# EAGLE board ACB-Lite 3.2 (EAGLE 8.6.3), part 1 of 2
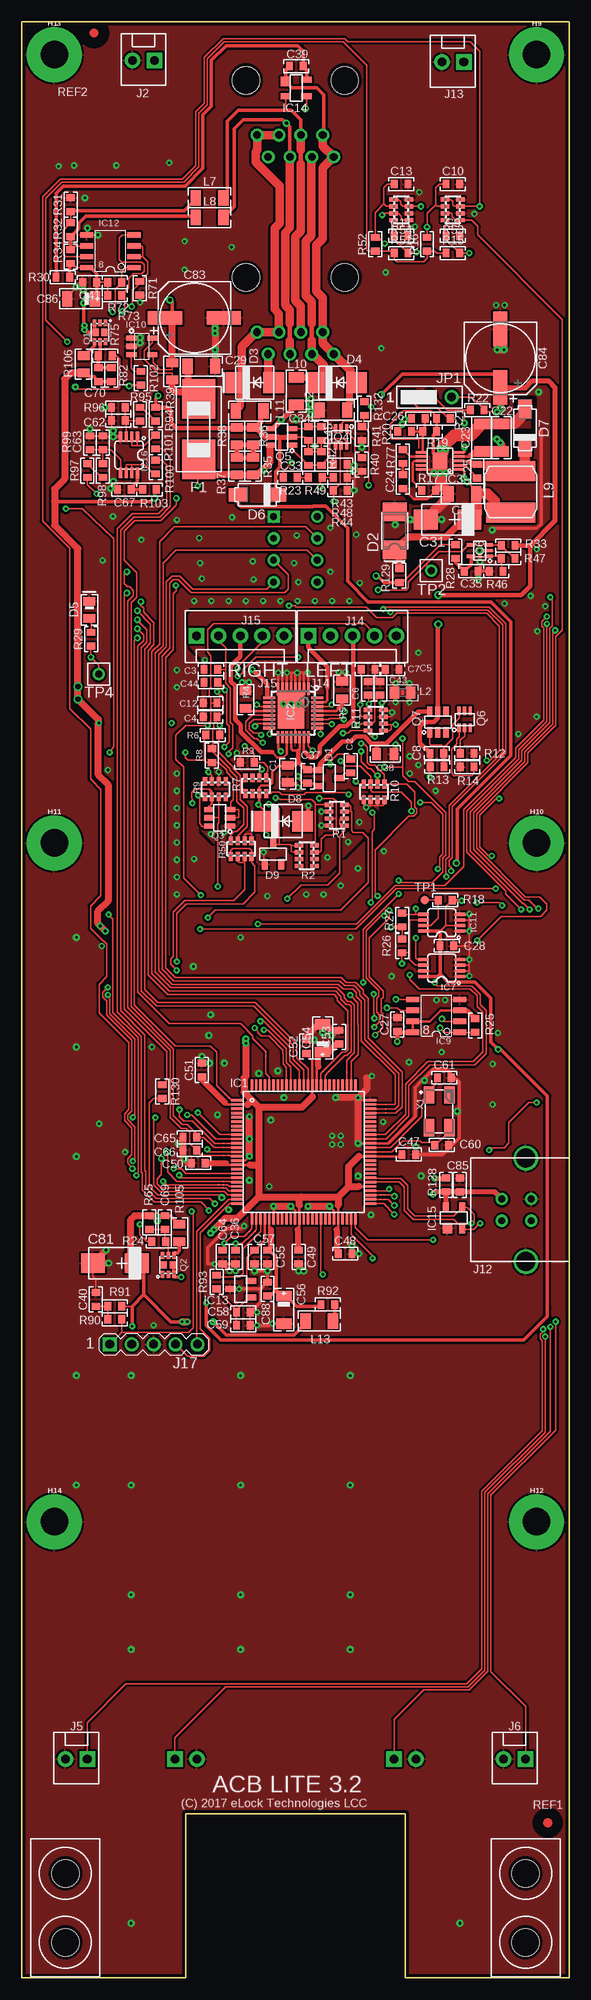
[diagram p3: board, top side]
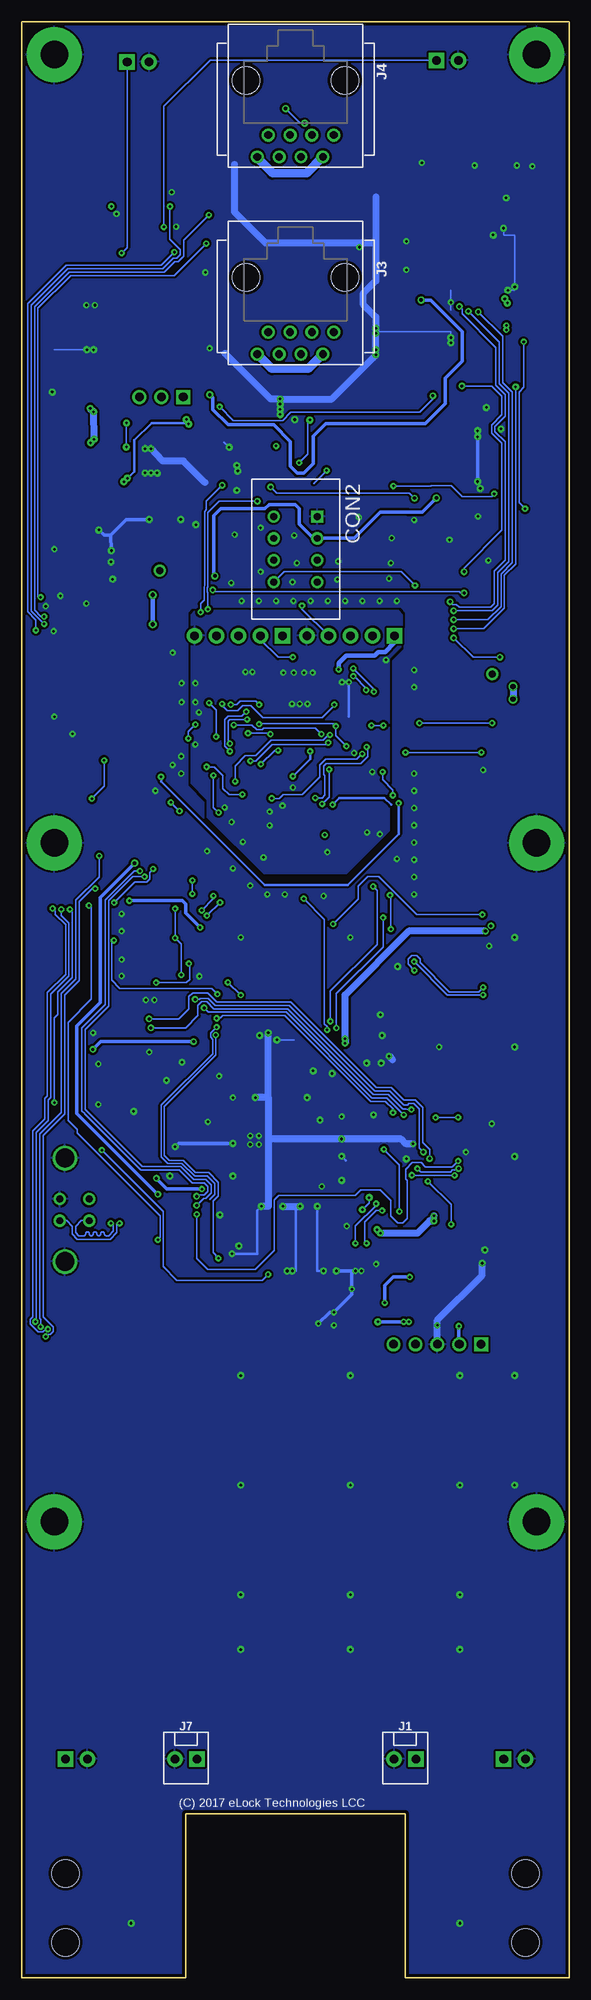
[diagram p4: board, bottom side, seen from below]

Size 63.5 x 226.82 mm. Coordinates in mm from the lower left corner, seen from the top.
Outline: 63.5,0 63.5,226.82 0,226.82 0,0 19.05,0 19.05,19.05 44.45,19.05 44.45,0 63.5,0
Copper layers (1*16): Top 0.035mm / dielectric 1.5mm / Bottom 0.035mm
Design rules "Class_6_0,15mm_0.2mm_conservative_set *": minimum track width 0.2mm, minimum drill 0.3mm, track to track 0.15mm, track to pad 0.15mm, pad to pad 0.2mm, via to via 0.15mm, smd to smd 0.2mm, copper to edge 0.35mm, drill to drill 0.2mm, minimum pad ring 0.3mm, minimum via ring 0.2mm, stop-mask expansion 0.1mm, vias tented up to drill 0.6mm, thermal gap 0.25mm
Net classes: 0 LV: drill 0.3 mm; 1 HV: drill 0.3 mm, clearance 0.3 mm to class 0
tRestrict: 34 lines

## Footprints (pad centres in the part's own frame; a part is rotated, then mirrored left to right if it is on the bottom)
0805 = smd 0.99 x 1.39: 1 -1,0; 2 1,0
0603 = smd 0.79 x 0.99: 1 -0.8,0; 2 0.8,0
1206 = smd 1.19 x 1.79: 1 -1.6,0; 2 1.6,0
CT-C = smd 2.743 x 2.311: + -2.54,0; - 2.54,0
1206-POL-C = smd 1.19 x 1.79: + -1.6,0; - 1.6,0
CAP_8MM_DIA_SMT = smd 1.59 x 3.99: 1 0,3.4; 2 0,-3.4
166087-4 = drill 0.8 square: 1 -3.81,2.54 | drill 0.8: 2 -1.27,2.54; 3 1.27,2.54; 4 3.81,2.54; 5 3.81,-2.54; 6 1.27,-2.54; 7 -1.27,-2.54; 8 -3.81,-2.54
SOT-23 = smd 0.69 x 1.19: 1 0.95,1.2; 2 -0.95,1.2; 3 0,-1.2
SMA = smd 2.159 x 2.743: + -2.311,0.003; - 2.108,-0.002
SMB = smd 2.4 x 2.4: A 2.2,0; C -2.2,0
0805-POL-D = smd 0.99 x 1.39: A 1,0; K -1,0
SMA' = smd 2.21 x 1.575: A -2.223,0; K 2.223,0
LITTLEFUSE0154 = smd 4.6 x 3.8: 1 3.5,0; 2 -3.5,0
CAM-HOLDER = hole 3.2: 0,4; 0,-4
STANDOFF-ELECTRICAL = drill 3.2 pad 6.35: P1 0,0
TQFP100_14X14_0,5MM = smd 1.39 x 0.28: 1 -7.7,6; 2 -7.7,5.5; 3 -7.7,5; 4 -7.7,4.5; 5 -7.7,4; 6 -7.7,3.5; 7 -7.7,3; 8 -7.7,2.5; 9 -7.7,2; 10 -7.7,1.5; 11 -7.7,1; 12 -7.7,0.5; 13 -7.7,0; 14 -7.7,-0.5; 15 -7.7,-1; 16 -7.7,-1.5; 17 -7.7,-2; 18 -7.7,-2.5; 19 -7.7,-3; 20 -7.7,-3.5; 21 -7.7,-4; 22 -7.7,-4.5; 23 -7.7,-5; 24 -7.7,-5.5; 25 -7.7,-6; 51 7.7,-6; 52 7.7,-5.5; 53 7.7,-5; 54 7.7,-4.5; 55 7.7,-4; 56 7.7,-3.5; 57 7.7,-3; 58 7.7,-2.5; 59 7.7,-2; 60 7.7,-1.5; 61 7.7,-1; 62 7.7,-0.5; 63 7.7,0; 64 7.7,0.5; 65 7.7,1; 66 7.7,1.5; 67 7.7,2; 68 7.7,2.5; 69 7.7,3; 70 7.7,3.5; 71 7.7,4; 72 7.7,4.5; 73 7.7,5; 74 7.7,5.5; 75 7.7,6 | smd 0.28 x 1.39: 26 -6,-7.7; 27 -5.5,-7.7; 28 -5,-7.7; 29 -4.5,-7.7; 30 -4,-7.7; 31 -3.5,-7.7; 32 -3,-7.7; 33 -2.5,-7.7; 34 -2,-7.7; 35 -1.5,-7.7; 36 -1,-7.7; 37 -0.5,-7.7; 38 0,-7.7; 39 0.5,-7.7; 40 1,-7.7; 41 1.5,-7.7; 42 2,-7.7; 43 2.5,-7.7; 44 3,-7.7; 45 3.5,-7.7; 46 4,-7.7; 47 4.5,-7.7; 48 5,-7.7; 49 5.5,-7.7; 50 6,-7.7; 76 6,7.7; 77 5.5,7.7; 78 5,7.7; 79 4.5,7.7; 80 4,7.7; 81 3.5,7.7; 82 3,7.7; 83 2.5,7.7; 84 2,7.7; 85 1.5,7.7; 86 1,7.7; 87 0.5,7.7; 88 0,7.7; 89 -0.5,7.7; 90 -1,7.7; 91 -1.5,7.7; 92 -2,7.7; 93 -2.5,7.7; 94 -3,7.7; 95 -3.5,7.7; 96 -4,7.7; 97 -4.5,7.7; 98 -5,7.7; 99 -5.5,7.7; 100 -6,7.7
SQFP-S-5X5-32 = smd 0.3 x 1.4: 1 -1.75,-2.8; 2 -1.25,-2.8; 3 -0.75,-2.8; 4 -0.25,-2.8; 5 0.25,-2.8; 6 0.75,-2.8; 7 1.25,-2.8; 8 1.75,-2.8; 17 1.75,2.8; 18 1.25,2.8; 19 0.75,2.8; 20 0.25,2.8; 21 -0.25,2.8; 22 -0.75,2.8; 23 -1.25,2.8; 24 -1.75,2.8 | smd 1.4 x 0.3: 9 2.8,-1.75; 10 2.8,-1.25; 11 2.8,-0.75; 12 2.8,-0.25; 13 2.8,0.25; 14 2.8,0.75; 15 2.8,1.25; 16 2.8,1.75; 25 -2.8,1.75; 26 -2.8,1.25; 27 -2.8,0.75; 28 -2.8,0.25; 29 -2.8,-0.25; 30 -2.8,-0.75; 31 -2.8,-1.25; 32 -2.8,-1.75 | smd 3.1 x 4.3: G 0.25,-0.35
MSOP10EXP = smd 0.29 x 1.19: 1 -1,-2.2; 2 -0.5,-2.2; 3 0,-2.2; 4 0.5,-2.2; 5 1,-2.2; 6 1,2.2; 7 0.5,2.2; 8 0,2.2; 9 -0.5,2.2; 10 -1,2.2 | smd 1.88 x 1.68: EP 0,0
SC-70-5 = smd 0.39 x 0.99: 1 -0.65,-1; 2 0,-1; 3 0.65,-1; 4 0.65,1; 5 -0.65,1
MSOP-08 = smd 0.38 x 1.2: 1 -1,-2.1; 2 -0.35,-2.1; 3 0.3,-2.1; 4 0.95,-2.1; 5 0.95,2.1; 6 0.3,2.1; 7 -0.35,2.1; 8 -1,2.1
SO-08 = smd 0.61 x 1.524: 1 -1.905,-2.743; 2 -0.635,-2.743; 3 0.635,-2.743; 4 1.905,-2.743; 5 1.905,2.743; 6 0.635,2.743; 7 -0.635,2.743; 8 -1.905,2.743
SOT23-5 = smd 0.6 x 1.2: 1 -0.95,-1.206; 2 0,-1.206; 3 0.95,-1.206; 4 0.95,1.206; 5 -0.95,1.206
SO08 = smd 0.61 x 1.524: 1 -1.905,-2.743; 2 -0.635,-2.743; 3 0.635,-2.743; 4 1.905,-2.743; 5 1.905,2.743; 6 0.635,2.743; 7 -0.635,2.743; 8 -1.905,2.743
SOT23 = smd 0.69 x 1.19: 1 0.95,1.2; 2 -0.95,1.2; 3 0,-1.2
SOT-143 = smd 1.09 x 1.19: 1 -0.75,-1.2 | smd 0.69 x 1.19: 2 0.95,-1.2; 3 0.95,1.2; 4 -0.95,1.2
3-641215-2 = drill 1 pad 1.8 square: 1 1.27,0 | drill 1 pad 1.8: 2 -1.27,0
RJ8-8-180 = drill 0.9 pad 1.4: 1 -4.445,6.35; 2 -3.175,8.89; 3 -1.905,6.35; 4 -0.635,8.89; 5 0.635,6.35; 6 1.905,8.89; 7 3.175,6.35; 8 4.445,8.89 | hole 3.2: 5.715,0; -5.715,0
USB_B_180 = drill 0.8 pad 1.4: 1_+5V 1.25,2.8; 2_D- -1.25,2.8; 3_D+ -1.25,-0.6; 4_GND 1.25,-0.6 | drill 2.2 pad 2.8: SH1 -6,0; SH2 6,0
3-641215-5 = drill 1 pad 1.8 square: 1 5.08,0 | drill 1 pad 1.8: 2 2.54,0; 3 0,0; 4 -2.54,0; 5 -5.08,0
MA05-1 = drill 1 pad 1.6 square: 1 -5.08,0 | drill 1 pad 1.6: 2 -2.54,0; 3 0,0; 4 2.54,0; 5 5.08,0
JP3CLOSE12 = drill 1 pad 1.626 square: 1 -2.54,0 | drill 1 pad 1.626: 2 0,0; 3 2.54,0
0805-0RTOP = smd 1.092 x 1.397: 1 -0.94,0; 2 0.94,0
NR6028 = smd 2.3 x 5.7: 1 2.4,0; 2 -2.4,0
TEMP-PAD = smd 0.2 x 0.2: P$1 0,0
MICRO_FET = smd 0.4 x 0.8: 1 -0.65,-1.1; 2 0,-1.1; 3 0.65,-1.1; 4 0.65,1.1; 5 0,1.1; 6 -0.65,1.1 | smd 0.7 x 0.86: P1 -0.5,0; P2 0.5,0
SSOT-6 = smd 0.6 x 1.2: 1 -0.95,-1.2; 2 0,-1.2; 3 0.95,-1.206; 4 0.95,1.2; 5 0,1.2; 6 -0.95,1.2
SC70-6 = smd 0.39 x 0.99: 1 -0.65,-1; 2 0,-1; 3 0.65,-1; 4 0.65,1; 5 0,1; 6 -0.65,1
0603-ARRAY = smd 0.49 x 0.99: 1 -1.2,-0.9; 2 -0.4,-0.9; 3 0.4,-0.9; 4 1.2,-0.9; 5 1.2,0.9; 6 0.4,0.9; 7 -0.4,0.9; 8 -1.2,0.9
SMD_ROUND_1MM = smd 1 x 1: P$1 0,0
TH_ROUND_14MM08MM = drill 0.8 pad 1.4: P$1 0,0
7B = smd 2 x 1.2: 1 -1.9,-1.2; 2 1.9,-1.2; 3 1.9,1.2; 4 -1.9,1.2

## Placement (x,y rotation side)
C1  4.7u/16V  [0805]  30.86,139.62 270 top
C2  10nF  [0603]  38.16,140.52 90 top
C3  10nF  [0603]  21.96,151.72 180 top
C4  10nF  [0603]  21.86,146.22 180 top
C5  10nF  [0603]  42.96,151.72 0 top
C6  10nF  [0603]  40.16,149.52 90 top
C7  10nF  [0603]  40.16,151.72 0 top
C8  100n  [0603]  48.15,142 0 top
C9  10nF  [0603]  50,201.99 0 top
C10  10nF  [0603]  50,207.99 0 top
C11  10nF  [0603]  44,201.99 0 top
C12  10nF  [0603]  21.86,147.82 180 top
C13  10nF  [0603]  44,207.99 0 top
C22  4u7/50  [1206]  55.6,178.59 90 top
C23  4u7/50  [1206]  53.35,178.59 90 top
C24  1n  [0603]  44.2,173.49 90 top
C25  470n/25  [0603]  52.8,174.69 270 top
C26  10p  [0603]  46,180.79 0 top
C27  100n  [0603]  43.57,110.55 90 top
C28  100n  [0603]  49.31,119.67 0 top
C29  4u7/50  [1206]  20.84,186.87 0 top
C30  47u/6.3  [1206]  51.1,172.09 180 top
C31  47uTC  [CT-C]  49.4,169.09 180 top
C33  100n  [0603]  33.24,176.17 270 top
C34  1n  [0603]  33.24,179.07 90 top
C35  100n  [0603]  52.1,163.09 0 top
C36  100n  [0603]  24.81,83.57 270 top
C37  1u/16V  [0603]  33.16,139.32 270 top
C38  4.7u/16V  [0805]  42.16,141.92 0 top
C39  100n  [0603]  31.85,221.65 180 top
C40  100n  [0603]  8.61,78.67 90 top
C41  100n  [0603]  7.9,196.59 180 top
C43  10nF  [0603]  41.56,149.52 90 top
C44  10nF  [0603]  21.96,150.22 180 top
C47  100n  [0603]  44.91,95.47 0 top
C48  1u  [0603]  37.51,83.97 0 top
C49  100n  [0603]  32.11,83.57 270 top
C50  1u  [0603]  20.51,94.47 180 top
C51  100n  [0603]  20.91,105.27 90 top
C52  1u  [0603]  33.01,107.97 90 top
C53  10u  [0603]  36.81,109.07 90 top
C54  10uTA  [1206-POL-C]  34.91,108.97 90 top
C55  100n  [0603]  28.51,83.57 270 top
C56  10uTA  [1206-POL-C]  30.41,77.47 270 top
C57  100n->10n  [0603]  27.01,83.57 270 top
C58  100n  [0603]  25.71,77.17 0 top
C59  1u->100n  [0603]  25.71,75.67 0 top
C60  18p  [0603]  48.71,96.57 0 top
C61  18p  [0603]  49.01,104.37 0 top
C62  1n  [0603]  11.23,180.58 180 top
C63  1n  [0603]  9.43,177.98 90 top
C64  100n  [0603]  23.31,83.57 270 top
C65  1n  [0603]  19.51,97.47 180 top
C66  10n  [0603]  19.51,95.97 180 top
C67  10u  [0603]  11.93,172.58 180 top
C69  1n  [0603]  16.61,87.57 270 top
C70  1n  [0603]  8.9,185.89 90 top
C81  47uTC  [CT-C]  10.81,82.87 180 top
C83  220u/25V  [CAP_8MM_DIA_SMT]  20.04,192.47 90 top
C84  220u/25V  [CAP_8MM_DIA_SMT]  55.5,187.79 180 top
C85  100n  [0603]  50.81,91.94 90 top
C86  10uTA  [1206-POL-C]  6.9,194.69 180 top
C88  10u  [0603]  28.51,79.87 90 top
CON2  166087-4  [166087-4]  31.75,165.64 270 bottom
D1  BAT54S  [SOT-23]  35.66,139.12 90 top
D2  SMLVT3V3  [SMA]  43.25,167.89 90 top
D3  P6SMB20A  [SMB]  27.04,184.97 0 top
D4  P6SMB20A  [SMB]  36.64,184.97 0 top
D5  LED-GREEN  [0805-POL-D]  7.86,158.62 270 top
D6  SS14  [SMA']  27.34,171.97 0 top
D7  SS14  [SMA']  58.35,179.69 270 top
D8  P6SMB16A  [SMB]  30.36,134.12 0 top
D9  BZX84C6V2  [SOT-23]  29.16,130.32 180 top
F1  T1A-LITTLEFUSE0154  [LITTLEFUSE0154]  20.54,179.57 90 top
H1  CAM-HOLDER  [CAM-HOLDER]  58.42,8.13 0 top
H2  CAM-HOLDER  [CAM-HOLDER]  5.08,8.13 0 top
H9  STANDOFF_ELECTRICAL  [STANDOFF-ELECTRICAL]  59.7,222.99 0 top
H10  STANDOFF_ELECTRICAL  [STANDOFF-ELECTRICAL]  59.7,131.59 0 top
H11  STANDOFF_ELECTRICAL  [STANDOFF-ELECTRICAL]  3.8,131.59 0 top
H12  STANDOFF_ELECTRICAL  [STANDOFF-ELECTRICAL]  59.7,52.89 0 top
H13  STANDOFF_ELECTRICAL  [STANDOFF-ELECTRICAL]  3.8,222.99 0 top
H14  STANDOFF_ELECTRICAL  [STANDOFF-ELECTRICAL]  3.8,52.89 0 top
IC1  PIC32MX470F512L-I/PF  [TQFP100_14X14_0,5MM]  32.71,95.77 0 top
IC2  L6227Q  [SQFP-S-5X5-32]  31.49,146.66 180 top
IC3  LT3971EMSE  [MSOP10EXP]  48.5,175.89 90 top
IC6  MIC841LYC  [SC-70-5]  53.1,165.49 90 top
IC7  24LC32A-I/MS  [MSOP-08]  48.71,117.12 90 top
IC9  AT25SF321-SSHD  [SO-08]  48.07,111.55 90 top
IC10  MAX9938HEUK+T  [SOT23-5]  13.94,189.17 270 top
IC11  24LC32A-I/MS  [MSOP-08]  48.71,122.37 90 top
IC12  SN65HVD12D  [SO08]  10.3,200.19 90 top
IC13  REF3025  [SOT23]  25.41,79.87 270 top
IC14  TPD2E001DZDR  [SOT-143]  31.83,219.13 270 top
IC15  TPD2E001DZDR  [SOT-143]  50.11,88.14 0 top
IC16  MCP6042-I/MS  [MSOP-08]  12.43,176.58 180 top
J1  3-641215-2  [3-641215-2]  19.05,25.39 0 bottom
J2  3-641215-2  [3-641215-2]  14.13,222.33 0 top
J3  RJ8-8-180  [RJ8-8-180]  31.75,197.15 180 bottom
J4  RJ8-8-180  [RJ8-8-180]  31.75,220.02 180 bottom
J5  3-641215-2  [3-641215-2]  6.35,25.39 0 top
J6  3-641215-2  [3-641215-2]  57.15,25.39 0 top
J7  3-641215-2  [3-641215-2]  44.45,25.39 0 bottom
J12  USB_A_180  [USB_B_180]  58.47,89.05 90 top
J13  3-641215-2  [3-641215-2]  49.99,222.14 0 top
J14  3-641215-5  [3-641215-5]  38.36,155.62 180 top
J15  3-641215-5  [3-641215-5]  25.36,155.62 180 top
J17  DNP-open-hole  [MA05-1]  15.31,73.47 0 top
JP1  JP3CLOSE12  [JP3CLOSE12]  47.3,183.29 0 top
L2  DNP  [0805-0RTOP]  44.16,149.02 0 top
L7  HI1206T500R  [1206]  21.8,206.39 0 top
L8  HI1206T500R  [1206]  21.8,204.09 0 top
L9  NR6028T4R7M  [NR6028]  56.7,172.29 90 top
L10  HI1206T500R  [1206]  31.84,183.97 90 top
L11  HI1206T500R  [1206]  26.44,181.67 180 top
L12  HI1206T500R  [1206]  36.14,181.77 0 top
L13  LQM31PN3R3M00L  [1206]  34.51,76.17 0 top
O1  PIC-OUT  [TEMP-PAD]  24.01,102.07 0 top
O5  PIC-RPX  [TEMP-PAD]  24.01,97.77 0 top
O6  PIC-RPX  [TEMP-PAD]  24.01,96.77 0 top
O7  PIC-RPX  [TEMP-PAD]  24.01,96.27 0 top
O8  PIC-RPX  [TEMP-PAD]  24.01,95.37 0 top
O12  PIC-RPX  [TEMP-PAD]  23.41,92.37 0 top
O13  PIC-RPX  [TEMP-PAD]  23.41,91.57 0 top
O15  PIC-RPX  [TEMP-PAD]  26.41,86.57 90 top
O16  PIC-RPX  [TEMP-PAD]  27.01,86.57 0 top
O23  PIC-OUT  [TEMP-PAD]  28.31,106.87 0 top
O29  PIC-RPX  [TEMP-PAD]  31.51,106.87 0 top
O30  PIC-RPX  [TEMP-PAD]  31.91,106.87 0 top
O31  PIC-OUT  [TEMP-PAD]  34.91,105.07 0 top
O41  PIC-RPX  [TEMP-PAD]  42.06,90.77 180 top
O42  PIC-RPX  [TEMP-PAD]  41.61,90.27 180 top
O44  PIC-OUT  [TEMP-PAD]  23.41,91.97 0 top
Q1  SSM6P49NU,LFPZ  [MICRO_FET]  9.1,190.79 180 top
Q2  SSM6P49NU,LFPZ  [MICRO_FET]  17.01,82.67 0 top
Q3  FDC6330L  [SSOT-6]  22.96,134.52 90 top
Q4  FDG6303N  [SC70-6]  37.04,178.67 180 top
Q5  FDC6506P  [SSOT-6]  30.14,178.67 90 top
Q6  FDG6303N  [SC70-6]  51.36,145.92 0 top
Q7  FDC6506P  [SSOT-6]  48.26,145.62 0 top
R1  100K  [0603-ARRAY]  36.56,134.82 270 top
R2  10K  [0603-ARRAY]  33.06,130.12 270 top
R3  300R  [0603]  26.16,140.92 0 top
R4  0.12R  [0805]  25.96,148.22 270 top
R5  0.12R  [0805]  37.16,149.32 270 top
R6  2K  [0603]  22.16,144.12 0 top
R7  3.3K  [0603-ARRAY]  27.16,138.22 0 top
R8  2K  [0603]  22.06,141.72 90 top
R9  100K  [0603-ARRAY]  22.46,137.82 180 top
R10  1M  [0603-ARRAY]  40.86,137.52 0 top
R11  10K  [0603-ARRAY]  41.06,145.82 270 top
R12  1M  [0603]  51.65,142 0 top
R13  1M  [0603]  48.16,140.42 0 top
R14  300k  [0603]  51.64,140.4 0 top
R15  2K  [0603]  50,199.99 0 top
R16  2K  [0603]  47,200.99 90 top
R17  47k  [0603]  47.2,172.49 0 top
R18  10k  [0603]  49.11,124.97 180 top
R19  560k  [0603]  47.3,179.29 0 top
R20  1M  [0603]  44.4,179.29 0 top
R21  1M  [0603]  48.9,180.79 180 top
R22  4M99  [0603]  52.8,181.79 180 top
R23  1M  [0603]  31.14,173.97 180 top
R24  100k  [0603]  15.91,85.37 180 top
R25  1M  [0603]  52.57,110.45 90 top
R26  10k  [0603]  44.11,119.67 270 top
R27  10k  [0603]  44.11,122.67 90 top
R28  100R  [0603]  50.3,165.39 90 top
R29  300R  [0603]  8.06,155.22 90 top
R30  10k  [0603]  4.8,197.19 0 top
R31  1M  [0603]  5.7,205.59 90 top
R32  1M  [0603]  5.7,202.69 270 top
R33  4M99  [0603]  56.4,166.09 0 top
R34  1M  [0603]  5.7,199.59 90 top
R35  1k  [0805]  26.84,175.27 90 top
R36  1k  [0805]  26.84,178.77 90 top
R37  1k  [0805]  24.94,175.27 90 top
R38  1k  [0805]  24.94,178.77 90 top
R39  0.025R  [0805]  17.44,186.27 270 top
R40  300k  [0603]  39.44,175.47 90 top
R41  1M  [0603]  39.44,179.07 270 top
R42  1M  [0603]  34.74,176.17 270 top
R43  300k  [0603]  36.94,175.47 180 top
R44  1M  [0603]  36.94,172.47 0 top
R45  1M  [0603]  34.74,179.07 90 top
R46  560k->750k  [0603]  55,163.09 0 top
R47  100k->180k  [0603]  56.4,164.59 0 top
R48  1M  [0603]  36.94,173.97 180 top
R49  560k  [0603]  34.04,173.97 180 top
R50  100K  [0603-ARRAY]  25.46,130.92 0 top
R51  2K  [0603]  44,199.99 0 top
R52  2K  [0603]  41,200.99 90 top
R53  100K  [0603-ARRAY]  50,204.99 90 top
R54  100K  [0603-ARRAY]  44,204.99 90 top
R65  1M  [0603]  14.81,87.57 270 top
R71  10k  [0603]  13.7,195.89 270 top
R72  1M  [0603]  10.8,196.59 0 top
R73  1M  [0603]  10.8,195.09 180 top
R75  100k  [0603]  9.7,188.09 0 top
R77  47k  [0603]  44.2,176.39 270 top
R82  1M  [0603]  10.4,185.89 90 top
R90  1k  [0603]  10.81,76.37 0 top
R91  10k  [0603]  10.81,77.87 0 top
R92  10R  [0603]  35.51,78.07 180 top
R93  300R  [0603]  22.61,80.67 270 top
R94  180k  [0603]  15.53,181.28 270 top
R95  4M99  [0603]  13.73,181.28 270 top
R96  560k  [0603]  11.23,182.08 180 top
R97  180k  [0603]  7.63,174.78 90 top
R98  4M99  [0603]  9.43,174.78 90 top
R99  560k  [0603]  7.93,177.98 90 top
R100  2k2  [0603]  15.53,175.18 270 top
R101  2k2  [0603]  15.53,178.08 90 top
R102  1k  [0603]  13.84,185.47 270 top
R103  300R  [0603]  14.83,172.58 0 top
R105  1R  [0805]  18.31,86.37 90 top
R106  1R  [0805]  7.2,187.09 270 top
R128  10k  [0603]  49.2,91.95 90 top
R129  DNP/0R  [0603]  43.8,162.59 90 top
R130  100k  [0603]  16.31,102.77 270 top
R132  1M  [0603]  39.74,181.97 270 top
REF1  REF  [REF]  61,17.99 0 top
REF2  REF  [REF]  8.4,225.49 0 top
T1  PIC-OUT  [TEMP-PAD]  50.85,143.11 0 top
T3  PIC-RPX  [TEMP-PAD]  23.46,96.27 180 top
T5  PIC-OUT  [TEMP-PAD]  42.06,90.27 180 top
T7  PIC-OUT  [TEMP-PAD]  41.61,90.77 180 top
T13  PIC-RPX  [TEMP-PAD]  31.51,107.42 0 top
T14  PIC-RPX  [TEMP-PAD]  31.91,107.42 270 top
T15  PIC-OUT  [TEMP-PAD]  35.26,105.42 270 top
T27  PIC-OUT  [TEMP-PAD]  23.46,96.77 270 top
T32  PIC-OUT  [TEMP-PAD]  22.86,91.97 270 top
T33  PIC-OUT  [TEMP-PAD]  28.31,107.42 270 top
T36  PIC-OUT  [TEMP-PAD]  23.61,102.47 0 top
T37  PIN-AN  [TEMP-PAD]  26.01,86.17 0 top
T38  PIN-AN  [TEMP-PAD]  26.61,86.17 270 top
T39  PIN-AN  [TEMP-PAD]  23.46,95.37 270 top
T40  PIC-RPX  [TEMP-PAD]  42.23,100.77 90 top
T41  PIC-RPX  [TEMP-PAD]  42.23,101.27 90 top
T42  PIC-OUT  [TEMP-PAD]  42.23,100.27 90 top
T43  PIC-RPX  [TEMP-PAD]  37.71,105.06 90 top
T44  PIC-OUT  [TEMP-PAD]  35.62,105.07 90 top
T45  PIC-RPX  [TEMP-PAD]  51.44,165.77 180 top
TP1  DNP-TestPoint  [SMD_ROUND_1MM]  46.71,124.97 0 top
TP2  DNP-TestPoint  [TH_ROUND_14MM08MM]  47.5,163.19 0 top
TP4  DNP-TestPoint  [TH_ROUND_14MM08MM]  8.94,151.15 180 top
X1  8MHz-5x3.2mm  [7B]  48.41,100.47 270 top

## Tracks (layer width: path | path; a pad name or v marks a point on that pad's centre or on a via)
+3,3V-FILT
  Top 0.4: R28.1 50.34,164.07 C35.1 52.14,163.87 IC6.5
+3.3V  (via drill 0.3, 0.3 pad 0.7, 0.3 pad 0.8, 0.35, 0.4, 0.4 pad 0.8, 0.6)
  Top 0.2: R105.2 18.51,87.37 | 12.81,77.87 R91.2 | R129.1 43.94,161.87 44.24,161.87 48.54,166.17 R28.2 | R103.2 15.43,172.38 v15.43,171.58 | 17.41,145.51 v17.39,145.49 | 8.9,145.49 v8.96,145.49
  Top 0.28: C47.1 44.31,95.27 IC1.62 39.11,95.27 | 23.61,101.47 23.61,101.27 IC1.2 26.21,101.27 | 23.71,94.47 23.71,94.27 IC1.16 26.51,94.27 | 32.01,86.77 32.21,86.77 IC1.37 32.21,89.57 | 32.01,84.77 32.01,84.37 C49.1 | 36.51,86.77 36.71,86.77 IC1.46 36.71,89.57 | IC1.55 39.11,91.77 | C52.1 33.01,107.07 33.71,106.37 IC1.86 33.71,102.17
  Top 0.3: C69.1 16.51,88.37
  Top 0.4: R82.1 C70.1 8.42,185.63 7.92,185.63 7.42,186.13 R106.2 7.02,186.13 | v15.71,88.37 C69.1 17.31,88.37 R105.2 | v12.81,75.57 12.81,77.87 14.16,79.22 | 14.16,79.22 14.16,82.06 C81.+ | v22.21,76.07 23.71,74.57 31.61,74.57 32.91,75.87 L13.1 | v18.61,76.07 17.31,76.07 14.16,79.22 | v15.43,171.58 14.99,171.14 3.89,171.14 3.84,171.19 | R129.1 42.05,161.78 41.3,162.54 v41.1,162.54
  Top 0.68: C51.1 20.91,104.17 23.61,101.47 | C50.1 23.71,94.47 | 32.01,86.77 32.01,84.77 | 36.51,86.77 36.51,84.47 36.71,84.27 C48.1
  Top 0.8: R28.2 50.24,166.17 | C81.+ 12.61,82.87 12.61,87.87 13.11,88.37 R65.1 v15.71,88.37 v15.71,87.77 | 26.71,101.77 25.81,102.67 25.81,104.37 26.01,104.57 v26.01,108.37 v26.01,108.87 | 26.21,101.27 26.71,101.77 | 26.71,101.77 27.51,100.97 | 27.51,100.97 27.51,94.27 | 27.51,94.27 27.51,90.57 | 27.51,90.57 25.01,88.07 23.61,88.07 v22.31,86.77 | 27.51,100.97 32.51,100.97 33.71,102.17 | 27.51,90.57 32.41,90.57 | 32.41,90.57 36.71,90.57 | 36.71,90.57 37.91,91.77 | 37.91,91.77 37.91,94.07 39.11,95.27 | 37.91,91.77 39.11,91.77 | 36.71,90.57 36.71,89.57 | 32.21,89.57 32.21,90.37 32.41,90.57 | 26.51,94.27 27.51,94.27 | 18.81,76.07 v18.61,76.07 v19.21,76.07 | 8.9,122.19 v9.1,121.99 | v9.73,121.36 v9.1,121.99 | v9.1,121.99 8.85,122.24 8.85,123.69 10.1,124.94 10.1,138.29 8.9,139.49 8.9,145.49 8.9,145.9 v6.54,148.26 v6.54,149.72 6.54,165.74 3.84,168.43 3.84,171.19 3.84,172.63 5,173.79 5,185.39 5.7,186.09 R106.2
  Bottom 0.2: v17.39,145.49 v8.96,145.49
  Bottom 0.4: J17.2 12.81,73.51 v12.81,75.57 | v19.21,76.07 v22.21,76.07 | 18.63,169.94 18.63,169.93 | 18.63,169.93 17.08,169.93 v15.43,171.58 | 18.63,169.93 21.9,169.93 24.93,166.91 CON2.2 29.67,166.91 31.3,168.54 31.3,170.34 31.8,170.84 34.8,170.84 35.3,170.34 40.4,170.34 41.2,169.54 41.2,162.64 v41.1,162.54
  Bottom 0.8: v26.01,108.37 v26.01,108.87 26.01,113.98 18.63,121.36 v9.73,121.36 | v22.31,86.77 v21.91,86.37 17.61,86.37 16.21,87.77 v15.71,87.77 v15.71,88.37 | v6.54,149.72 6.54,148.35 6.51,148.32
+3.3V/1  (via drill 0.3, 0.3 pad 0.7, 0.35)
  Top 0.2: R27.1 R26.1 | IC11.2 49.16,122.02 | 49.16,122.02 48.51,121.37 | R18.1 49.16,124.22 49.16,122.02
  Top 0.3: IC9.3 48.6,112.18 47.33,110.91 IC9.7 45.32,109.78 45.19,109.64 | IC9.8 45.19,109.64 | 45.19,109.64 43.68,109.64
  Top 0.4: v21.41,78.27 21.41,75.67 23.11,73.97 58.21,73.97 60.95,76.71 60.95,77.65 | Q2.P2 17.66,82.67 Q2.3 17.66,81.27 v18.51,81.27 | IC11.8 48.51,121.37 C28.1 48.51,116.37 | 60.95,77.65 | 60.95,77.65 60.95,102.23 55.52,107.66 v55.25,107.66 54.4,108.51 54.4,113.59 52.52,115.47 49.41,115.47 48.51,116.37 | v43.55,108.56 43.55,109.5 | 48.51,116.37 48.26,116.12 IC7.8 | R27.1 42.88,121.87 v42.8,121.79 | v51,124.89 49.99,124.89 R18.1
  Top 0.5: R25.2 51.63,112.18 IC9.3 | C27.1 43.55,109.73 | 43.55,109.73 v43.55,108.56 | IC9.8 43.63,109.64 43.55,109.73
  Bottom 0.4: v18.51,81.27 20.41,81.27 21.41,80.27 v21.41,78.27 | v55.25,107.66 54.35,108.56 v43.55,108.56 | v42.8,121.79 44.5,123.49 44.5,124.49 44.9,124.89 v51,124.89
+3.3V/2  (via drill 0.3, 0.3 pad 0.8)
  Top 0.2: R34.1 5.84,198.77 6.34,198.26 IC12.8 | C41.1 R72.1 R73.2
  Top 0.3: 8.47,190.98 Q1.P2
  Top 0.4: Q1.3 8.47,190.98 | IC12.8 8.04,198.26 8.74,197.57 C41.1 8.74,194.87 C86.+ v7.5,194.69 7.24,194.37 v7.2,194.19 7.2,191.69 v7.3,191.59 v7.3,191.09 7.6,190.79 Q1.P2 | R34.1 5.6,198.69 R30.2
/3.3V1PWRON  (via drill 0.3 pad 0.7)
  Top 0.2: v13.71,87.37 13.71,86.17 14.51,85.37 R24.2 | IC1.21 24.11,91.77 23.91,91.97 O44.P$1 T32.P$1 16.81,91.97 v16.41,92.37
  Bottom 0.2: v13.71,87.37 13.71,89.67 v16.41,92.37
/3.3V2PWRON  (via drill 0.3 pad 0.8, 0.35)
  Top 0.2: 10.62,188.23 R75.2 11,188.09 11.4,187.69 11.4,184.39 11.2,184.19 6.52,184.19 v6.24,184.47 | IC1.96 28.71,104.47 28.31,104.87 O23.P$1 T33.P$1 26.8,108.93 26.8,109.24 25.4,110.64 17.14,110.64 13.49,114.29 13.49,154.42 14.14,155.07 14.14,155.7 v13.42,156.42
  Bottom 0.2: 13.42,156.4 v13.42,156.42 9.94,156.42 7.53,158.83 7.53,162.62 6.24,163.9 v6.24,184.47
/FMEM1-CS  (via drill 0.3 pad 0.7, 0.35)
  Top 0.2: IC1.11 O6.P$1 T27.P$1 22.41,96.77 19.81,99.37 18.81,99.37 18.31,99.87 v18.31,100.67 | v48.51,110.15 49.01,109.64 IC9.1 52.55,109.64
  Top 0.5: R25.1 52.55,109.64
  Bottom 0.2: v48.51,110.15 44.5,110.15 43.06,111.58 43.06,112.76 42.64,113.18 42.04,113.18 41.22,112.37 32.65,112.37 22.72,102.44 21.01,102.44 19.34,100.77 18.92,100.77 18.82,100.67 v18.31,100.67
/MCLR  (via drill 0.3 pad 0.7)
  Top 0.2: IC1.13 21.81,95.77 v21.51,96.07 | 11.63,74.87 19.41,74.87 19.91,75.37 19.91,88.67 v19.71,88.87 | 11.63,74.87 J17.1 | 11.63,74.87 11.63,76.35 R90.2
  Bottom 0.2: v19.71,88.87 19.71,94.27 v21.51,96.07
A+  (via drill 0.4)
  Top 0.2: IC14.3 33.03,216.87 v32.9,216.74
  Top 0.4: L8.2 23.44,204.17 24.64,205.37 24.64,214.38 25.7,215.44 30.3,215.44 v30.7,215.04 31.1,214.63 J4.4
  Top 0.5: 31.1,189.84 31.1,191.77
  Top 1: 31.1,191.77 31.1,193.4 30.54,193.97 30.54,202.37 31.1,202.93 J4.4 | J3.4 31.11,189.84 31.1,189.84
  Bottom 0.2: v32.9,216.74 31.2,215.04 v30.7,215.04
A++
  Top 0.2: R34.2 5.84,200.37 6.24,200.77 7.56,200.77 IC12.6
  Top 0.4: L8.1 20.04,204.27 7.46,204.27 6.62,203.43 6.62,202.79 R32.2 5.73,200.37 R34.2
ACT-L-SENSE  (via drill 0.3)
  Top 0.2: R1.8 37.96,136.02 38.16,135.82 38.16,135.32 | 38.16,135.32 38.26,135.22 38.26,133.02 38.46,132.82 39.56,132.82 40.2,132.18 40.2,126.99 37,123.79 22.45,123.79 v21.6,122.94 | R1.7 38.06,135.22 38.16,135.32 | IC1.92 30.71,105.57 30.31,105.97 30.31,107.16 30.3,107.17 30.3,107.61 28.69,109.22 27.79,109.22 27.38,109.63 27.38,109.76 v27.01,110.14
  Bottom 0.2: v27.01,110.14 27.01,110.62 27,110.63 27,114.14 21.6,119.54 v21.6,122.94
ACT-L-SW  (via drill 0.3 pad 0.7)
  Top 0.2: v32.06,153.12 27.16,153.12 25.66,151.62 25.66,151.32 25.26,150.92 v25.06,150.92 | R2.8 34.06,131.42 34.06,136.02 | 34.06,136.02 R1.1 | 34.06,136.02 34.06,136.22 33.66,136.62 32.51,136.62 32.46,136.57 31.81,136.57 31.76,136.62 29.96,136.62 29.76,136.82 v29.46,136.82 | v23.51,142.72 24.06,143.27 24.06,145.12 23.76,145.42 23.76,149.12 v23.56,149.32 23.56,149.52 22.86,150.22 C44.1
  Bottom 0.2: J14.2 35.82,155.18 33.76,153.12 v32.06,153.12 | v23.56,149.32 23.56,149.52 24.96,150.92 v25.06,150.92 | v29.46,136.82 28.66,136.82 28.36,137.12 28.36,139.42 28.46,139.52 28.46,139.54 28.48,139.56 28.48,140.5 28.16,140.82 24.16,140.82 23.36,141.62 23.36,142.57 v23.51,142.72
ACT-R-SENSE  (via drill 0.3)
  Top 0.2: R1.6 36.96,134.42 36.86,134.32 36.86,133.72 36.96,133.62 R1.5 37.46,133.02 36.86,132.42 36.86,128.1 35.5,126.74 32.4,126.74 v30.8,125.14 | IC1.91 31.21,105.64 30.71,106.14 30.71,107.33 30.7,107.34 30.7,107.78 28.56,109.92 v28.08,109.92
  Bottom 0.2: v28.08,109.92 28.08,110.31 28.4,110.63 28.4,122.74 v30.8,125.14
ACT-R-SW  (via drill 0.3 pad 0.7)
  Top 0.2: J15.2 22.82,155.06 23.66,154.22 23.66,151.72 | 36.46,134.42 36.46,132.82 36.16,132.52 35.26,132.52 34.76,132.02 34.76,130.72 34.56,130.52 R2.7 | 36.46,134.42 R1.3 | 36.46,134.42 36.46,136.47 36.16,136.77 v34.51,136.77 | 23.66,151.72 23.66,150.12 24.21,149.57 24.21,145.57 24.46,145.32 24.46,142.62 24.06,142.22 24.06,141.97 v24.01,141.92 | C3.1 23.66,151.72
  Bottom 0.2: v34.51,136.77 33.61,136.77 33.16,137.22 30.96,137.22 28.96,139.22 28.96,140.62 28.26,141.32 24.66,141.32 24.06,141.92 v24.01,141.92
ACT_EN  (via drill 0.3, 0.3 pad 0.7)
  Top 0.2: 44.16,140.42 v44.16,143.72 | 42.76,145.32 42.06,145.32 R11.6 | v43.36,145.32 42.76,145.32 | R11.5 42.66,144.62 42.86,144.82 42.86,145.22 42.76,145.32 | v37.91,137.22 37.71,137.42 32.96,137.42 32.76,137.22 30.16,137.22 29.86,137.52 29.06,137.52 28.86,137.32 R7.4 | v42.06,140.42 44.16,140.42 | 44.16,140.42 44.16,139.43 44.87,138.72 45.57,138.72 49.2,135.09 49.2,130.17 48.85,129.82 48.85,128.25 47.6,127 43.95,127 v43.7,127.25 | IC1.77 38.21,106.25 39,107.04 39,110.47 38.99,110.48 38.99,113.05 v38.1,113.94 | v39.58,115.42 39.58,121.57 v43.7,125.69
  Bottom 0.2: v44.16,143.72 44.16,144.52 v43.36,145.32 | v37.91,137.22 39.46,137.22 40.16,137.92 40.16,139.42 41.16,140.42 v42.06,140.42 | v43.7,125.69 v43.7,127.25 | v38.1,113.94 v39.58,115.42
ACT_L1  (via drill 0.3, 0.3 pad 0.7)
  Top 0.2: IC2.27 35.55,145.91 35.66,146.02 37.26,146.02 v37.36,145.92 | v39.36,143.12 39.66,143.12 40.06,142.72 40.06,140.92 40.36,140.62 40.96,140.62 42.06,139.52 R10.5 44.67,138.42 45.6,137.49 45.6,135.74 45.8,135.54 45.8,135.04 45.45,134.69 44.9,134.69 41.01,130.8 41.01,125.69 v41.26,125.44 | IC1.49 38.21,86.23 40.7,83.74 v40.7,83.44 | v42.62,123.77 v42.62,123.76 42.62,122.92 40.28,120.58 40.28,116.06 41.9,114.45 41.9,113.69 41.71,113.5 41.71,111.91 41.84,111.79 41.84,110.16 v41,109.32
  Bottom 0.2: v37.36,145.92 39.36,145.92 39.56,145.72 39.56,143.32 v39.36,143.12 | v40.7,83.44 41,83.74 41,83.83 41.3,84.13 41.3,90.09 40.71,90.68 40.71,92.25 41.82,93.37 43.35,93.37 44.76,94.78 46.39,94.78 46.95,95.33 46.95,101.04 41,106.99 v41,109.32 41.15,109.32 | v42.62,123.77 41.26,125.13 v41.26,125.44
ACT_L2  (via drill 0.3, 0.3 pad 0.7)
  Top 0.2: IC2.28 35.15,146.41 35.16,146.42 36.86,146.42 37.26,146.82 v37.46,146.82 | v39.36,142.22 39.36,141.02 40.16,140.22 40.46,140.22 v41.26,139.42 R10.6 | v40.66,135.12 40.86,134.92 40.86,133.12 40.66,132.92 40.66,124.84 v40.5,124.68 | v42.02,123.16 41.67,123.16 39.93,121.43 39.93,115.92 41.4,114.45 41.4,113.82 41.16,113.58 41.16,111.97 41.49,111.64 41.49,110.83 v40.9,110.24
  Bottom 0.2: v37.46,146.82 37.96,146.32 39.56,146.32 39.96,145.92 39.96,143.38 39.98,143.36 39.98,142.84 v39.36,142.22 | v41.26,139.42 41.26,135.72 v40.66,135.12 | 41.7,90.25 41.11,90.85 41.11,92.09 41.98,92.97 43.45,92.97 44.91,94.43 46.54,94.43 47.3,95.19 47.3,101.19 41.35,107.14 41.35,108.82 41.6,109.07 41.6,109.57 41.25,109.92 41.21,109.92 v40.9,110.24 | v40.5,124.68 v42.02,123.16
ACT_L+
  Top 0.3: IC2.31 35.25,147.91 35.46,148.12 35.46,149.62
  Top 0.5: 35.46,149.62 35.46,152.02 33.26,154.22 33.26,155.6 J14.1
ACT_L-
  Top 0.3: IC2.23 32.74,142.24 32.86,142.12
  Top 0.5: 32.86,142.12 33.46,141.52 34.06,141.52 34.56,142.02 34.56,142.82 36.86,145.12 37.66,145.12 38.46,145.92 38.46,155.52 J14.3
ACT_R1  (via drill 0.3, 0.3 pad 0.7)
  Top 0.2: IC2.13 26.75,146.41 26.01,145.67 26.01,144.67 26.96,143.72 27.26,143.72 27.76,143.22 v27.96,143.22 | v36.98,141.1 37.56,140.52 39.26,140.52 40.46,139.32 R10.7 40.46,137.72 40.66,137.52 44.03,137.52 45.2,136.35 v45.2,135.29 | v47.7,85.59 40.14,85.59 38.71,87.02 IC1.50 | v55.7,124.34 55.36,124.67 v52.78,124.67 | v46.2,136.29 47.5,136.29 48.85,134.94 48.85,130.31 48.5,129.96 48.5,128.89 48.25,128.64 v48.25,128.59
  Bottom 0.2: v27.96,143.22 28.16,143.02 34.46,143.02 36.38,141.1 v36.98,141.1 | v55.7,124.34 55.4,124.34 55.4,113.5 58.1,110.8 58.1,99.41 57.05,98.36 57.05,97.94 47.45,88.33 47.45,85.89 47.7,85.64 v47.7,85.59 | v52.78,124.67 50.37,127.08 49,127.08 48.64,127.43 48.64,128.19 v48.25,128.59 | v45.2,135.29 v46.2,136.29
ACT_R2  (via drill 0.3 pad 0.7)
  Top 0.2: IC2.14 26.9,145.91 26.41,145.42 26.41,144.82 26.91,144.32 27.56,144.32 v27.76,144.12 | R10.8 39.06,138.42 v38.76,138.72
  Bottom 0.2: v27.76,144.12 27.96,144.12 28.56,143.52 34.56,143.52 36.36,141.72 37.56,141.72 38.76,140.52 v38.76,138.72
ACT_R+  (via drill 0.3 pad 0.7)
  Top 0.3: 28.46,148.52 28.46,148.41 IC2.9
  Top 0.5: 28.46,148.52 28.46,150.02 v26.76,151.72
  Bottom 0.5: v26.76,151.72 26.76,152.42 25.86,153.32 22.56,153.32 22.16,153.72 21.36,153.72 20.28,154.8 J15.1
ACT_R-
  Top 0.3: IC2.19 30.74,141.9 30.36,141.52 29.66,141.52 29.06,142.12
  Top 0.5: 29.06,142.12 27.76,142.12 25.41,144.47 25.41,145.27 24.76,145.92 24.76,149.82 24.26,150.32 24.26,152.12 25.36,153.22 J15.3
AVDD
  Top 0.28: IC1.30 28.71,86.77 28.91,86.77
  Top 0.4: C55.1 28.71,84.37 29.51,83.57 29.51,79.77 | 29.51,79.77 30.21,79.07 C56.+ 30.71,79.07 31.91,77.87 34.71,77.87 R92.2 | C88.1 28.81,79.07 29.51,79.77
  Top 0.6: 28.91,84.87 28.91,84.77 C55.1
  Top 0.68: 28.91,86.77 28.91,84.87
B-
  Top 0.2: IC14.2 30.63,216.58 30.62,216.57
  Top 0.4: L7.2 23.44,206.77 23.84,207.17 23.84,215.28 25.13,216.57 30.62,216.57 31.27,216.57 32.38,215.45 J4.5 | J3.5
  Top 0.5: 32.38,211.91 32.38,210.35 32.37,210.34
  Top 1: J3.5 32.37,193.83 31.74,194.47 31.74,201.87 32.37,202.5 32.37,210.34 | J4.5 32.38,211.91
B--
  Top 0.2: 7.56,199.57 IC12.7 7.52,199.59 5.1,199.59 4.84,199.84 4.84,202.66 5.73,203.55 | R31.1 5.73,203.55 | 5.73,203.55 R32.1
  Top 0.4: L7.1 19.84,205.97 19.84,205.87 18.84,204.87 5.79,204.87
  Top 0.5: R31.1 5.79,204.85 5.79,204.87
BT-RTS
  Top 0.2: IC1.83 35.21,104.66 T44.P$1 37.48,106.93 37.67,106.93 38.19,107.44 38.19,112.61 37.96,112.84 37.64,112.84 37,113.48 37,113.8 36.39,114.41 17.14,114.41 15.09,116.46 15.09,153.75 16,154.66 16,166.54 17.7,168.24 32.96,168.24 CON2.7
BT-RX
  Top 0.2: IC1.73 T40.P$1 | T40.P$1 | T40.P$1 43.3,100.77 43.71,101.18 43.71,104.88 39.8,108.79 39.8,110.8 39.79,110.81 39.79,113.38 39.2,113.97 39.2,114.39 38.55,115.04 37.46,115.04 36.89,115.61 17.63,115.61 16.29,116.95 16.29,153.26 17.2,154.17 17.2,161.73 17.61,162.14 18.19,162.14 19.69,160.64 30.5,160.64 30.9,161.04 30.9,162.68 CON2.3
BT-TX
  Top 0.2: IC1.74 T41.P$1 | T41.P$1 | T41.P$1 43.19,101.27 43.31,101.39 43.31,104.72 39.4,108.63 39.4,110.64 39.39,110.65 39.39,113.21 38.8,113.8 38.8,114.23 38.39,114.64 37.29,114.64 36.72,115.21 17.47,115.21 15.89,116.79 15.89,153.42 16.8,154.33 16.8,161.89 17.44,162.54 18.35,162.54 19.85,161.04 28.42,161.04 CON2.4
CON-LED
  Top 0.2: IC1.78 T43.P$1 37.71,106.4 38.59,107.28 38.59,112.78 38.13,113.24 37.81,113.24 37.4,113.65 37.4,113.97 36.56,114.81 17.3,114.81 15.49,116.62 15.49,153.59 16.4,154.5 16.4,164.04 17.9,165.54 33.12,165.54 CON2.6
CURR-SENSE  (via drill 0.35)
  Top 0.2: IC1.14 24.31,95.27 24.21,95.37 O8.P$1 T39.P$1 20.81,95.37 20.31,95.87 C66.1 19.51,96.77 19.51,98.07 19.11,98.47 18.51,98.47 17.21,99.77 17.21,107.56 12.29,112.48 12.29,159.62 12.94,160.27 12.94,160.87 12.51,161.29 12.25,161.29 11.89,161.66 11.89,162.71 v12.21,163.04
  Top 0.3: R102.2 12.59,184.67 v12.48,184.56
  Bottom 0.2: 12.21,163.29 v12.21,163.04 12.21,163.48 7.84,167.85 7.84,177.93 9.03,179.12 9.03,180.03 7.84,181.22 7.84,183.38 9.02,184.56 v12.48,184.56
D_N  (via drill 0.3)
  Top 0.2: v53.15,87.5 52.85,87.5 52.85,87.21 52.41,86.77 51.23,86.77 IC15.2 51.06,86.99 50.11,87.94 45.42,87.94 44.37,88.99 44.37,91.72 43.79,92.3 41.27,92.3 41.24,92.27 IC1.56
  Bottom 0.2: J12.2_D- 56.61,87.8 57.25,87.16 57.25,86.41 56.88,86.05 56.28,86.05 arc-90 56.08,86.25 56.08,86.28 arc90 55.88,86.48 55.84,86.48 arc90 55.64,86.28 55.64,86.25 arc-90 55.44,86.05 55.4,86.05 arc-90 55.2,86.25 55.2,86.28 arc90 55,86.48 54.97,86.48 arc90 54.77,86.28 54.77,86.25 arc-90 54.57,86.05 54.53,86.05 arc-90 54.33,86.25 54.33,86.28 arc90 54.13,86.48 54.09,86.48 arc90 53.89,86.28 53.89,86.25 arc-90 53.69,86.05 53.38,86.05 52.85,86.58 52.85,87.5 v53.15,87.5
D_P  (via drill 0.3)
  Top 0.2: v52.15,87.5 52.45,87.5 52.45,88.54 51.65,89.34 IC15.3 51.06,89.29 50.11,88.34 45.59,88.34 44.77,89.16 44.77,91.89 43.96,92.7 41.27,92.7 41.2,92.77 IC1.57
  Bottom 0.2: J12.3_D+ 58.29,87.8 57.65,87.16 57.65,86.24 57.05,85.65 53.21,85.65 52.45,86.41 52.45,87.5 v52.15,87.5
DGND  (via drill 0.3 pad 0.7, 0.3 pad 0.8)
  Top 0.2: R96.2 C62.2 10.43,179.58 v10.63,179.38 v10.63,178.68 9.53,178.68 C63.2 R99.2 | C58.2 C59.2 | 38.64,173.97 39.34,174.67 R40.1 39.24,174.67 v38.54,175.37 38.44,175.47 R43.1 | R71.2 v13.74,194.27 | v39.44,177.47 R41.2 | v7.14,195.67 C41.2 | C86.- 5.34,194.97 6.34,195.97 v6.34,196.07 | v7.64,202.87 7.64,202.12 IC12.5 8.73,202.07 8.74,202.07 v8.84,202.07 | R48.1 38.64,173.97 | C51.2 v21.81,106.07 | R44.2 v38.54,172.47 38.64,172.57 38.64,173.97 | C40.2 8.61,81.07 8.27,81.41 C81.- | 27.61,78.27 27.61,79.77 27.71,79.87 | IC11.4 51.91,123.32 v51.91,123.37 51.91,122.67 | IC11.3 51.91,122.67 | 51.91,122.67 v51.91,121.37 | IC7.1 51.91,116.12 v51.91,116.17 51.91,116.77 | IC7.2 51.91,116.77 | IC7.3 51.91,117.42 | 51.91,117.42 51.91,116.77 | IC7.4 v51.91,118.07 | v51.91,118.07 51.91,117.42 | IC11.1 v51.91,121.37 | v51.91,121.37 51.91,119.67 | 51.91,119.67 v51.91,118.07 | C28.2 51.91,119.67 | v22.41,82.77 C64.2 | v50.51,100.47 50.71,100.47 | IC3.10 46.34,174.87 | R21.2 48.1,181 47.41,181.69 44.28,181.69 42.8,180.2 42.8,178.57 42.98,178.39 46.05,178.39 46.05,177.34 | C23.2 53.35,180.17 53.24,180.07
  Top 0.28: IC1.45 36.21,88.97 v35.71,89.47 | v31.21,89.47 31.71,88.97 IC1.36 | IC1.31 v29.21,89.47 | IC1.15 25.91,94.77 v26.41,95.27 | IC1.75 39.31,101.77 v39.01,102.07 | C51.2 v20.91,106.87 | 42.61,96.87 42.51,96.77 IC1.65 v39.01,96.77
  Top 0.3: 46.34,174.87 48.54,174.87 | R19.2 R21.2 | C24.1 45.44,171.47 47.04,171.47 R17.2 48.59,173.02 | v39.11,83.97 C48.2 v38.31,84.87
  Top 0.4: 48.54,175.87 48.54,175.97 47.7,176.79 47.7,178.89 R19.2 | v49.2,177.29 48.84,177.27 v48.5,177.29 | IC6.2 v53.1,165.49 v53.14,164.17 53.14,163.27 C35.2 R46.1 | IC16.4 v10.63,178.68 | v10.33,172.68 10.43,172.58 C67.2 10.63,173.08 v10.63,173.48 | IC10.2 13.34,189.17 v13.74,189.57 v13.74,190.17 13.69,190.12 IC10.1 | IC13.3 v25.21,79.87 27.71,79.87 C88.2 v28.51,81.97 | C59.2 v27.31,75.67 28.71,75.67 28.91,75.87 v29.11,75.87 C56.- | 49.81,104.77 50.71,103.87 50.71,100.47 50.71,97.37 49.71,96.37 | 42.61,96.87 45.61,99.87 45.61,103.27 46.41,104.07 v46.71,104.07 46.71,104.37 47.71,105.37 49.21,105.37 49.81,104.77 | 49.81,104.77 C61.2 | 49.71,96.37 48.81,95.47 C47.2 v45.71,96.37 | 49.71,96.37 C60.2 | v54.54,167.87 54.74,168.07 59.74,168.07 60.24,168.57 60.24,179.52 | C49.2 v32.11,81.97 v32.71,81.97 | C57.2 27.01,82.07 | 27.01,82.07 v27.01,81.97 | C55.2 v28.51,81.97 | v28.51,81.97 27.11,81.97 27.01,82.07 | 27.61,78.27 C58.2 v27.31,77.17 | v25.81,87.17 25.51,86.87 23.81,86.87 21.61,84.67 21.61,82.77 v22.41,82.77 | C64.2 v24.11,81.97 v24.81,81.97 C36.2 C64.2
  Top 0.5: 45,148.66 45,148.68 44.96,148.72 v44.96,147.92 44.96,148.92 | 44.96,148.92 v44.96,150.12 | L2.2 45.1,148.92 44.96,148.92
  Top 0.8: v39.01,102.07 v36.41,102.07 | v47.8,174.49 v48.5,174.49 v49.2,174.49 | L12.1 34.54,182.17 33.54,182.17 v33.54,182.47 | v33.54,182.47 v33.54,181.87 v33.54,181.27 34.54,181.27 | v33.54,182.47 v33.54,183.07 | C29.2 v22.44,188.17 v22.44,188.77 v22.44,190.67 v22.44,191.27 22.44,192.47 C83.2 | v34.91,109.57 C54.- | v35.91,109.27 36.51,109.87 C53.2 35.91,109.87 35.21,110.57 C54.- | v33.91,108.77 C52.2 33.01,109.17 34.41,110.57 C54.- | 40.01,104.37 40.01,103.07 v39.01,102.07 | C31.- v45.05,169.09 44.74,169.07 44.44,169.37 43.95,169.37 D2.- | v31.21,89.47 v29.21,89.47 | v35.71,89.47 v33.21,89.47 | v39.01,96.77 v39.01,102.07 | v26.41,95.27 v26.41,97.27 v26.41,99.87 | C50.2 19.41,94.47 v18.91,94.97 18.71,95.17 C66.2 18.71,96.77 | 18.71,96.77 C65.2 | v18.11,96.72 18.66,96.72 18.71,96.77 | v9.81,84.41 C81.- v10.11,82.87 | v55.14,188.77 55.14,191.17 C84.2 55.94,191.17 v55.94,188.77 v55.14,188.77
  Top 0.813: v48.7,169.09 C31.-
  Top 1.2: C23.2 C22.2 57.15,180.19 58.34,181.52 D7.A | 48.54,174.87 48.54,175.87 48.54,176.37 48.64,176.47 arc90 48.74,176.57 48.74,176.97 48.84,176.97 | v48.5,174.49 48.54,173.07 48.59,173.02 C30.2 49.54,171.71 C31.-
  Top 1.4: 53.24,180.07 52.04,178.87 50.14,178.87 48.84,177.57 48.84,177.27 48.84,176.97
  Top 1.6: 48.54,174.87 v48.5,174.49
  Bottom 0.2: 40.04,178.07 v39.44,177.47 | v38.54,175.37 38.54,174.82 v38.44,174.72 | 13.74,190.07 v13.74,189.57 | 13.74,195.67 v13.74,194.27 13.74,193.37 | v7.64,202.87 7.64,202.07 6.34,202.07 v6.34,196.07 6.34,195.67 v7.14,195.67 | v13.74,190.17 13.74,190.87 22.24,190.87 v22.44,190.67 | 59.73,188.77 v55.94,188.77 | 31.91,108.77 v33.91,108.77
  Bottom 0.28: v26.41,95.27 25.91,94.77 | v39.11,83.97 36.21,83.97 36.21,88.97 v35.71,89.47 | v32.11,81.97 31.71,81.97 31.71,88.97 v31.21,89.47 | v28.51,81.97 29.21,81.97 v29.21,89.47
  Bottom 0.4: v10.63,173.48 v10.63,178.68 | v48.7,169.09 51.34,169.07 53.14,167.27 | v24.81,81.97 25.21,81.97 | 25.21,81.97 v27.01,81.97 | 25.21,81.97 v25.21,79.87 25.21,79.27 v27.31,77.17 27.81,77.17 v29.11,75.87 | 53.14,167.27 v53.1,165.49 | v54.54,167.87 53.94,167.27 53.14,167.27 | v45.71,96.37 45.31,96.77 v39.01,96.77
  Bottom 0.8: J17.3 15.31,76.27 10.11,81.47 v10.11,82.87 | 22.44,206.47 22.44,201.17 | 22.44,201.17 22.44,196.77 23.94,195.27 23.94,194.07 22.44,192.57 v22.44,191.27 v22.44,190.67 v22.44,188.77 v22.44,188.17 27.54,183.07 v33.54,183.07 34.64,183.07 39.94,188.37 | 38.84,210.27 38.84,204.77 35.24,201.17 22.44,201.17 | 34.91,102.07 v36.41,102.07 | 42.24,173.37 44.74,175.87 47.14,175.87 v48.5,177.29 | 34.91,102.07 34.91,97.27 | 34.91,97.27 34.91,89.47 v35.71,89.47 | v33.21,89.47 v31.21,89.47 | v18.11,96.72 18.96,96.72 19.51,97.27 v26.41,97.27 34.91,97.27 | 20.51,106.47 v20.91,106.87 | 34.91,102.07 v34.91,109.57
  other vias: 23.51,106.07 46.31,92.98 40.51,88.47 26.41,92.47 39.01,92.97 30.41,102.07 24.34,200.67 15.31,75.67 28.71,91.77 59.94,183.87 52.94,162.17 7.93,179.58 9.63,182.08 43.3,168.49 38.1,57.14 38.1,69.84 25.4,57.14 25.4,69.84 12.7,69.84 25.4,44.44 12.7,57.14 12.7,44.44 12.7,38.09 25.4,38.09 38.1,38.09 38.1,44.44 6.35,69.84 6.35,57.14 6.35,95.24 6.35,107.94 6.35,120.64 25.4,120.64 38.1,120.64 12.7,6.34 50.8,6.34 29.71,105.17 27.51,104.87 21.91,111.67 19.91,117.27 21.71,109.27 22.71,100.07 28.91,99.47 40.61,104.57 41.91,99.27 54.61,101.27 54.61,105.97 44.91,106.17 31.84,180.67 18,151.64 18,149.64 18,139.64 18,137.64 18,135.64 18,133.64 18,131.64 18,129.64 18,127.64 18,125.64 33,125.64 35,125.64 37,126.64 39,128.64 42,130.64 48,137.64 45,139.64 45,141.64 46,140.64 46,153.64 38,159.64 36,159.64 34,159.64 32,159.64 30,159.64 28,159.64 26,159.64 24,159.64 22,159.64 20,159.64 36,97.64 37,97.64 36,96.64 37,96.64 20.7,164.04 20.6,166.94 13.9,166.74 38.8,167.34 35.8,168.14 39.2,161.74 35.8,163.04 31.6,164.04 31.9,167.24 32.1,161.84 18,169.04 24.4,169.34 20.9,162.24 26.8,164.24 26.9,162.14 9.4,164.34 10.6,169.44 55.21,109.57 52.5,204.54 46.1,207.04 45.6,203.04 7.34,206.37 10,140.04 9.3,119.64 9,99.04 15.1,107.94 12,95.74 57.6,144.24 56,159.34 59.7,165.64 59,160.24 60.7,159.04 59.8,156.14 59.7,146.24 28.5,125.44 20,129.74 56,193.94 55,193.94 42.2,197.74 41.7,188.94 18.9,201.34 18.9,198.04 17.1,210.44 11,210.14 6.1,210.14 4.3,210.04 42.9,116.14 48.1,113.39 48.7,107.34 49.1,113.39
  pour Top (isolate 0.254, rank 2): 0,-0.01 19.05,-0.01 19.05,19.06 44.45,19.06 44.45,0 63.51,0 63.51,226.83 0,226.83
  pour Bottom (isolate 0.254, rank 2): 0,-0.01 19.05,-0.01 19.05,19.06 44.45,19.06 44.45,0 63.51,0 63.51,226.83 0,226.83
DGND-F
  Top 0.4: J4.7 35.02,213.77 35.02,218.35 34.21,219.17 31.34,219.17 IC14.1 30.63,221.22 C39.2
  Top 0.8: L12.2 37.94,181.97 37.94,182.47 38.04,182.57 38.04,184.37 38.74,185.07
  Top 1: D4.A 38.74,185.07 38.14,185.07 38.14,186.32 J3.8 34.92,189.53 J3.7 34.91,194.79 34.14,195.57 34.14,200.87 34.91,201.64 34.91,209.85 J4.8 34.92,212.4 J4.7 | 28.56,185.64 28.57,185.64 | 28.57,185.64 D3.A | J3.2 28.57,185.64
  Bottom 1: J3.2 30.27,186.57 34.47,186.57 36.17,188.26 J3.8 | J4.2 30.46,209.24 34.4,209.24 36.19,211.03 J4.8
DOOR_L  (via drill 0.3)
  Top 0.2: R50.2 25.06,129.52 25.26,129.32 25.86,129.32 | R50.3 25.86,129.32 | IC1.51 41.97,89.77 v43.2,88.54 | v17.97,116.82 17.97,116.87 17.3,117.55 17.3,118.13 17.6,118.43 17.6,123.6 18.93,124.94 24.6,124.94 25.86,126.2 25.86,129.32 | v10,114.84 9.4,114.24 9.4,113.74 9.9,113.24 9.9,111.62 12.8,108.72 12.8,100.54 12.3,100.04 12.3,99.54 13.15,98.69 13.15,94.96 v12.9,94.71
  Bottom 0.2: v43.2,88.54 43.2,83.44 41.9,82.14 36.4,82.14 34.21,84.33 34.21,90.23 33.7,90.74 24.8,90.74 24.2,91.34 21.9,91.34 20.7,90.14 20.7,88.34 19.9,87.54 19.3,87.54 18.8,88.04 18.8,92.44 19,92.64 19,93.74 18.19,94.54 17.2,94.54 16.7,94.04 13.57,94.04 v12.9,94.71 | v17.97,116.82 18.7,117.55 18.7,118.13 18.29,118.54 17.71,118.54 17.3,118.13 17.3,117.7 13.93,114.34 10.5,114.34 v10,114.84
DOOR_L_SW  (via drill 0.3, 0.3 pad 0.7)
  Top 0.2: J14.4 40.9,155.88 39.76,157.02 22.26,157.02 21.56,156.32 21.56,153.72 21.96,153.32 21.96,149.62 21.76,149.42 21.76,148.62 21.96,148.42 21.96,147.82 | R50.7 25.06,132.42 26.16,133.52 26.16,135.82 25.36,136.62 25.36,139.42 24.56,140.22 24.56,140.42 22.86,142.12 22.86,144.03 22.87,144.03 R6.2 v22.96,145.22 | 21.96,147.82 21.96,145.72 21.56,145.32 v21.56,145.22 19.03,145.22 17.9,144.09 17.9,141.29 18.8,140.39 18.8,127.54 v20.8,125.54 | C12.1 21.96,147.82 | v60.7,74.37 60.7,63.28 53.7,56.28 53.7,35.68 51.75,33.74 23.65,33.74 17.78,27.87 J1.1 | v20.7,121.59 38.75,121.59 43.46,126.3 v54.96,126.3
  Bottom 0.2: v21.56,145.22 v22.96,145.22 | 56.8,119.69 56.8,120.19 | 56.8,120.19 56.8,124.79 55.29,126.3 v54.96,126.3 | 56.8,120.19 56.81,120.18 56.81,115.66 58.5,113.97 58.5,100.19 61,97.69 61,76.62 59.85,75.47 59.85,74.97 60.2,74.62 60.45,74.62 v60.7,74.37 | v20.7,121.59 20.7,125.44 v20.8,125.54
DOOR_ON  (via drill 0.3)
  Top 0.2: R9.7 22.86,134.52 | 22.86,134.52 Q3.5 21.65,134.52 | 22.86,134.52 22.86,133.92 22.76,133.82 v22.76,126.54 22.76,126.52 | IC1.89 32.21,105.2 31.11,106.3 31.11,107.93 28.12,110.92 v27.7,110.92
  Bottom 0.2: v27.7,110.92 27.7,114.44 22.3,119.84 22.3,126.08 v22.76,126.54
DOOR_R  (via drill 0.3)
  Top 0.2: R50.1 24.26,130.72 24.46,130.92 26.46,130.92 26.66,130.72 R50.4 26.66,129.32 27.06,128.92 27.06,125.9 25.7,124.54 19.1,124.54 18,123.44 v18,117.84 | IC1.23 23.9,90.77 23.5,91.17 16.05,91.17 15.31,91.91 15.31,99.54 v15.51,99.74 | v10,113.99 10.25,113.74 10.25,111.77 13.15,108.87 13.15,100.04 v12.9,99.79
  Bottom 0.2: v18,117.84 14.15,113.99 v10,113.99 | v12.9,99.79 15.46,99.79 v15.51,99.74
DOOR_R_SW  (via drill 0.3, 0.3 pad 0.7)
  Top 0.2: J15.4 27.9,154.86 25.06,152.02 v25.06,151.82 | R50.8 24.26,132.52 24.66,132.92 24.96,132.92 25.76,133.72 25.76,135.62 24.96,136.42 24.96,139.22 24.16,140.02 24.16,140.22 22.06,142.32 R8.2 22.14,142.6 22.16,142.6 22.16,144.72 22.26,144.82 22.26,145.42 22.64,145.8 C4.1 22.86,146.22 23.36,146.72 23.36,148.52 23.16,148.72 22.96,148.72 22.66,149.02 v22.66,149.12 | v61.3,75.48 61.3,63.38 54.05,56.13 54.05,35.54 51.9,33.39 46.6,33.39 43.18,29.97 J7.1 | v31,159.09 31.7,159.09 31.85,158.94 39.95,158.94 41.15,157.74 43,157.74 43.5,158.24 53.91,158.24 55.4,156.75 55.4,142.28 54.28,141.16 v53.92,141.16 | v55.36,136.72 55.01,136.72 53.1,134.81 53.1,131.13 54.27,129.96 54.4,130.09 v54.5,130.09
  Bottom 0.2: v25.06,151.82 22.66,149.42 v22.66,149.12 | v61.3,75.48 61.3,76.34 61.4,76.44 61.4,97.85 58.9,100.35 58.9,114.13 57.21,115.82 57.21,120.34 57.2,120.35 57.2,124.96 54.5,127.66 v54.5,130.09 | J15.4 31,158.72 v31,159.09 | v53.92,141.16 53.92,138.16 v55.36,136.72
GATE-Q12A
  Top 0.2: Q5.1 31.34,177.27 C33.2 R42.2 35.74,176.37 35.74,178.17 36.04,178.47 37.34,178.47 37.69,178.12 Q4.6
GATE-Q12A1
  Top 0.2: Q7.1 47.31,143.11 47.46,142.96 48.64,142.96 48.93,142.66 | 48.93,142.66 49.96,143.68 49.96,145.3 50.71,146.05 Q6.6 | 48.93,142.66 48.96,142.64 48.96,141.97
  Top 0.5: C8.2 48.96,141.97 R13.2
GATE-Q12B
  Top 0.2: Q5.3 32.99,179.62 C34.2 R45.2 34.94,179.67 Q4.3
LAN-CTL  (via drill 0.35)
  Top 0.2: IC12.3 13.08,200.77 13.94,200.77 14.07,200.63 14.07,199.53 | IC1.84 34.71,104.87 O31.P$1 T15.P$1 37.17,107.33 37.51,107.33 37.79,107.61 37.79,112.13 36.6,113.32 36.6,113.64 36.23,114.01 16.94,114.01 14.69,116.26 14.69,153.92 15.34,154.57 15.34,157.16 14.14,158.36 14.14,158.82 13.83,159.13 v13.83,159.57 | 14.07,199.53 14.64,198.97 14.64,197.57 R71.1 13.44,196.67 13.44,196.27 12.84,195.67 12.84,193.87 v12.76,193.79 | 14.07,199.53 IC12.2
  Bottom 0.2: v12.76,193.79 12.44,193.47 12.44,192.93 8.54,189.02 8.54,184.65 7.44,183.55 7.44,181.06 8.63,179.87 8.63,179.29 7.44,178.1 7.44,164.4 8.73,163.11 8.73,159.32 9.13,158.92 12.79,158.92 13.11,159.24 13.5,159.24 v13.83,159.57
LAN-RX  (via drill 0.35)
  Top 0.2: 13.08,198.27 IC12.1 12.13,198.26 11.64,197.77 R72.2 10.84,195.77 10.84,193.43 v10.57,193.16 | IC1.88 32.71,105.27 31.51,106.47 O29.P$1 T13.P$1 31.51,108.1 26.91,112.7 15.64,112.7 13.89,114.45 13.89,154.25 14.54,154.9 14.54,156.32 13.41,157.45 v13.41,157.47
  Bottom 0.2: v13.41,157.47 9.45,157.47 7.93,158.99 7.93,162.78 6.64,164.07 6.64,183.88 7.74,184.98 7.74,190.33 v10.57,193.16
LAN-TX  (via drill 0.35)
  Top 0.2: 13.08,202.07 IC12.4 11.64,202.07 11.34,201.77 11.34,199.22 11.64,198.92 13.94,198.92 14.24,198.62 14.24,197.87 13.94,197.57 12.94,197.57 12.44,197.07 12.44,195.97 11.64,195.17 R73.1 11.94,194.77 11.94,193.45 v11.72,193.23 | IC1.87 33.21,105.37 31.91,106.67 O30.P$1 T14.P$1 31.91,108.28 27.09,113.1 15.81,113.1 14.29,114.62 14.29,154.09 14.94,154.73 14.94,156.99 v13.41,158.52
  Bottom 0.2: v11.72,193.23 8.14,189.65 8.14,184.81 7.04,183.71 7.04,164.24 8.33,162.95 8.33,159.16 8.97,158.52 v13.41,158.52
LED-PIC  (via drill 0.35)
  Top 0.2: IC1.1 24.31,101.77 O1.P$1 T36.P$1 22.61,103.47 22.61,107.33 21.86,108.08 17.82,108.08 13.09,112.81 13.09,155.04 v13.41,155.37 | R29.1 v8.05,153.12 8.94,152.23 TP4.P$1
  Top 0.4: R29.1
  Bottom 0.2: v8.05,153.12 11.16,153.12 v13.41,155.37
N$1  (via drill 0.3 pad 0.7)
  Top 0.2: IC2.25 34.65,144.91 34.66,144.92 v34.66,144.22 | v37.26,144.32 37.86,144.32 38.16,144.62 R11.4 40.16,144.32 40.56,143.92 v40.96,143.92 | v41.76,147.82 42.06,147.82 42.36,148.12 42.36,151.02 42.17,151.2 42.17,151.7 C5.1
  Bottom 0.2: v34.66,144.22 34.76,144.32 v37.26,144.32 | v40.96,143.92 40.96,147.02 v41.76,147.82
N$2  (via drill 0.3 pad 0.7)
  Top 0.2: IC2.16 28.69,144.29 v28.76,144.22 | v38.91,145.27 39.21,145.27 39.36,145.42 R11.3 40.66,145.42 40.96,145.72 40.96,148.02 41.56,148.62 C43.1
  Bottom 0.2: v28.76,144.22 29.46,144.92 35.41,144.92 35.61,144.72 36.26,144.72 36.81,145.27 v38.91,145.27
N$3  (via drill 0.3 pad 0.7)
  Top 0.2: IC2.11 27.47,147.41 v27.26,147.62 | R11.1 40.06,147.12 40.06,147.52 v40.26,147.72 40.26,148.42 40.16,148.52 C6.1
  Bottom 0.2: v27.26,147.62 27.26,147.52 28.66,146.12 35.56,146.12 36.96,147.52 37.86,147.52 38.46,146.92 39.66,146.92 40.06,147.32 40.06,147.52 v40.26,147.72
N$4
  Top 0.2: Q6.1 50.71,143.92 50.45,143.66 50.45,143.04 49.86,142.45 49.86,139.68 50.17,139.37 50.19,139.39 52.16,139.39 52.44,139.67 R14.2
N$5  (via drill 0.3)
  Top 0.2: R53.8 49.1,202.09 C9.1 49.2,201.59 R15.2 v51.9,199.99
  Bottom 0.2: J13.1 51.26,200.63 v51.9,199.99
N$6  (via drill 0.3 pad 0.7)
  Top 0.2: IC2.24 33.24,142.84 v33.76,142.32 | v35.76,140.72 35.76,141.02 36.66,141.92 37.86,141.92 38.16,141.62 C2.2
  Bottom 0.2: v33.76,142.32 34.16,142.32 v35.76,140.72
N$8  (via drill 0.3)
  Top 0.2: R53.6 48.2,205.39 48,205.59 | 48,205.59 48,207.59 48.4,207.99 C10.1 | R16.2 v47,202.99 47,204.59 48,205.59
  Bottom 0.2: J2.1 41.66,222.33 47,216.99 v47,202.99
N$9  (via drill 0.3)
  Top 0.2: R54.8 43.1,202.09 C11.1 43.2,201.59 R51.2 44.9,200.09 v45.8,200.09 | v59.9,123.99 59.79,123.99 58.79,124.99 58.25,124.99 52.4,130.84 52.4,135.1 58.35,141.06 58.35,142.15 61.6,145.4 61.6,155.99 v61.85,156.24 | v60.45,75.22 60.45,74.97 60.1,74.62 60.1,74.12 60.35,73.87 60.35,63.42 53.35,56.42 53.35,35.83 51.61,34.09 12.1,34.09 7.62,29.61 J5.1
  Bottom 0.2: v45.8,200.09 47.3,198.59 58.3,198.59 62.8,194.09 62.8,158.39 61.85,157.44 v61.85,156.24 | v59.9,123.99 59.6,123.69 59.6,123.32 58.41,122.13 58.41,116.32 60.5,114.23 60.5,102.24 60.8,101.94 60.8,99.58 62.2,98.18 62.2,76.64 62.5,76.34 62.5,75.84 61.55,74.88 61.05,74.88 60.72,75.22 v60.45,75.22
N$10  (via drill 0.3)
  Top 0.2: R54.6 42.3,205.39 42,205.69 | 42,205.69 42,207.59 42.4,207.99 C13.1 | 42,205.69 41,204.69 R52.2 41.4,201.79 v42.1,201.09 | v58.9,123.89 v58.89,123.89 58.19,124.59 58.09,124.59 52,130.68 52,135.2 58,141.2 58,142.29 61.25,145.54 61.25,156.49 61.5,156.74 61.5,160.09 v61.3,160.09 | v61.9,76.09 61.9,63.49 54.4,55.99 54.4,35.49 58.42,31.47 J6.1
  Bottom 0.2: v42.1,201.09 45.8,197.39 57.8,197.39 61.6,193.59 61.6,160.09 v61.3,160.09 | v58.9,123.89 58.9,123.19 58.01,122.3 58.01,116.15 60.1,114.06 60.1,102.08 60.4,101.78 60.4,99.42 61.8,98.02 61.8,76.19 v61.9,76.09
N$13
  Top 0.2: IC11.7 47.46,122.02 48.31,122.87 R18.2 TP1.P$1
N$14
  Top 0.2: R29.2 8.06,157.42 D5.A
N$16
  Top 0.2: Q4.1 37.69,179.32 38.64,178.37 38.64,177.07 R40.2
N$17
  Top 0.2: R43.2 36.39,175.72 Q4.4
N$18
  Top 0.4: IC14.4 33.03,221.26 C39.1 32.65,223.39 32,224.04 23.7,224.04 21.99,222.33 21.99,217 21.02,216.03 21.02,209.8 18.97,207.75 4.82,207.75 4,206.93 R30.1
N$19
  Top 0.2: 37.26,139.22 36.75,139.22 D1.3 36.93,139.12 37.53,139.72 C2.1
N$20
  Top 0.6: R38.1 R37.2 R35.2 R36.1 R38.1
N$21
  Top 0.2: R39.2 17.44,186.07 15.84,186.07 14.24,187.67 14.24,188.67 15.15,189.57 IC10.5
  Top 0.8: C29.1 19.24,183.87 | 19.24,183.87 20.04,183.07 F1.1 | 19.24,183.87 17.74,183.87 17.44,184.17 R39.2
N$24
  Top 0.4: R92.1 36.31,76.37 L13.2
N$27
  Top 0.2: IC6.1 55.39,164.82 R47.1 55.64,163.27 R46.2
N$28
  Top 0.2: R47.2 57.14,164.57 R33.1 55.59,166.12 IC6.3
N$29  (via drill 0.3 pad 0.7)
  Top 0.2: R7.6 27.56,139.82 v27.86,140.12 | v28.66,136.12 29.26,136.12 29.86,135.52 29.86,131.42 | 29.22,131.42 29.86,131.42 | R2.2 31.36,130.52 31.26,130.62 31.26,131.32 | 31.26,131.32 31.16,131.42 29.86,131.42 | 31.26,131.32 R2.1
  Top 0.5: D9.3 29.22,131.46 29.22,131.42